# EAGLE design Tally Box With Ethernet (EAGLE 9.4.2)
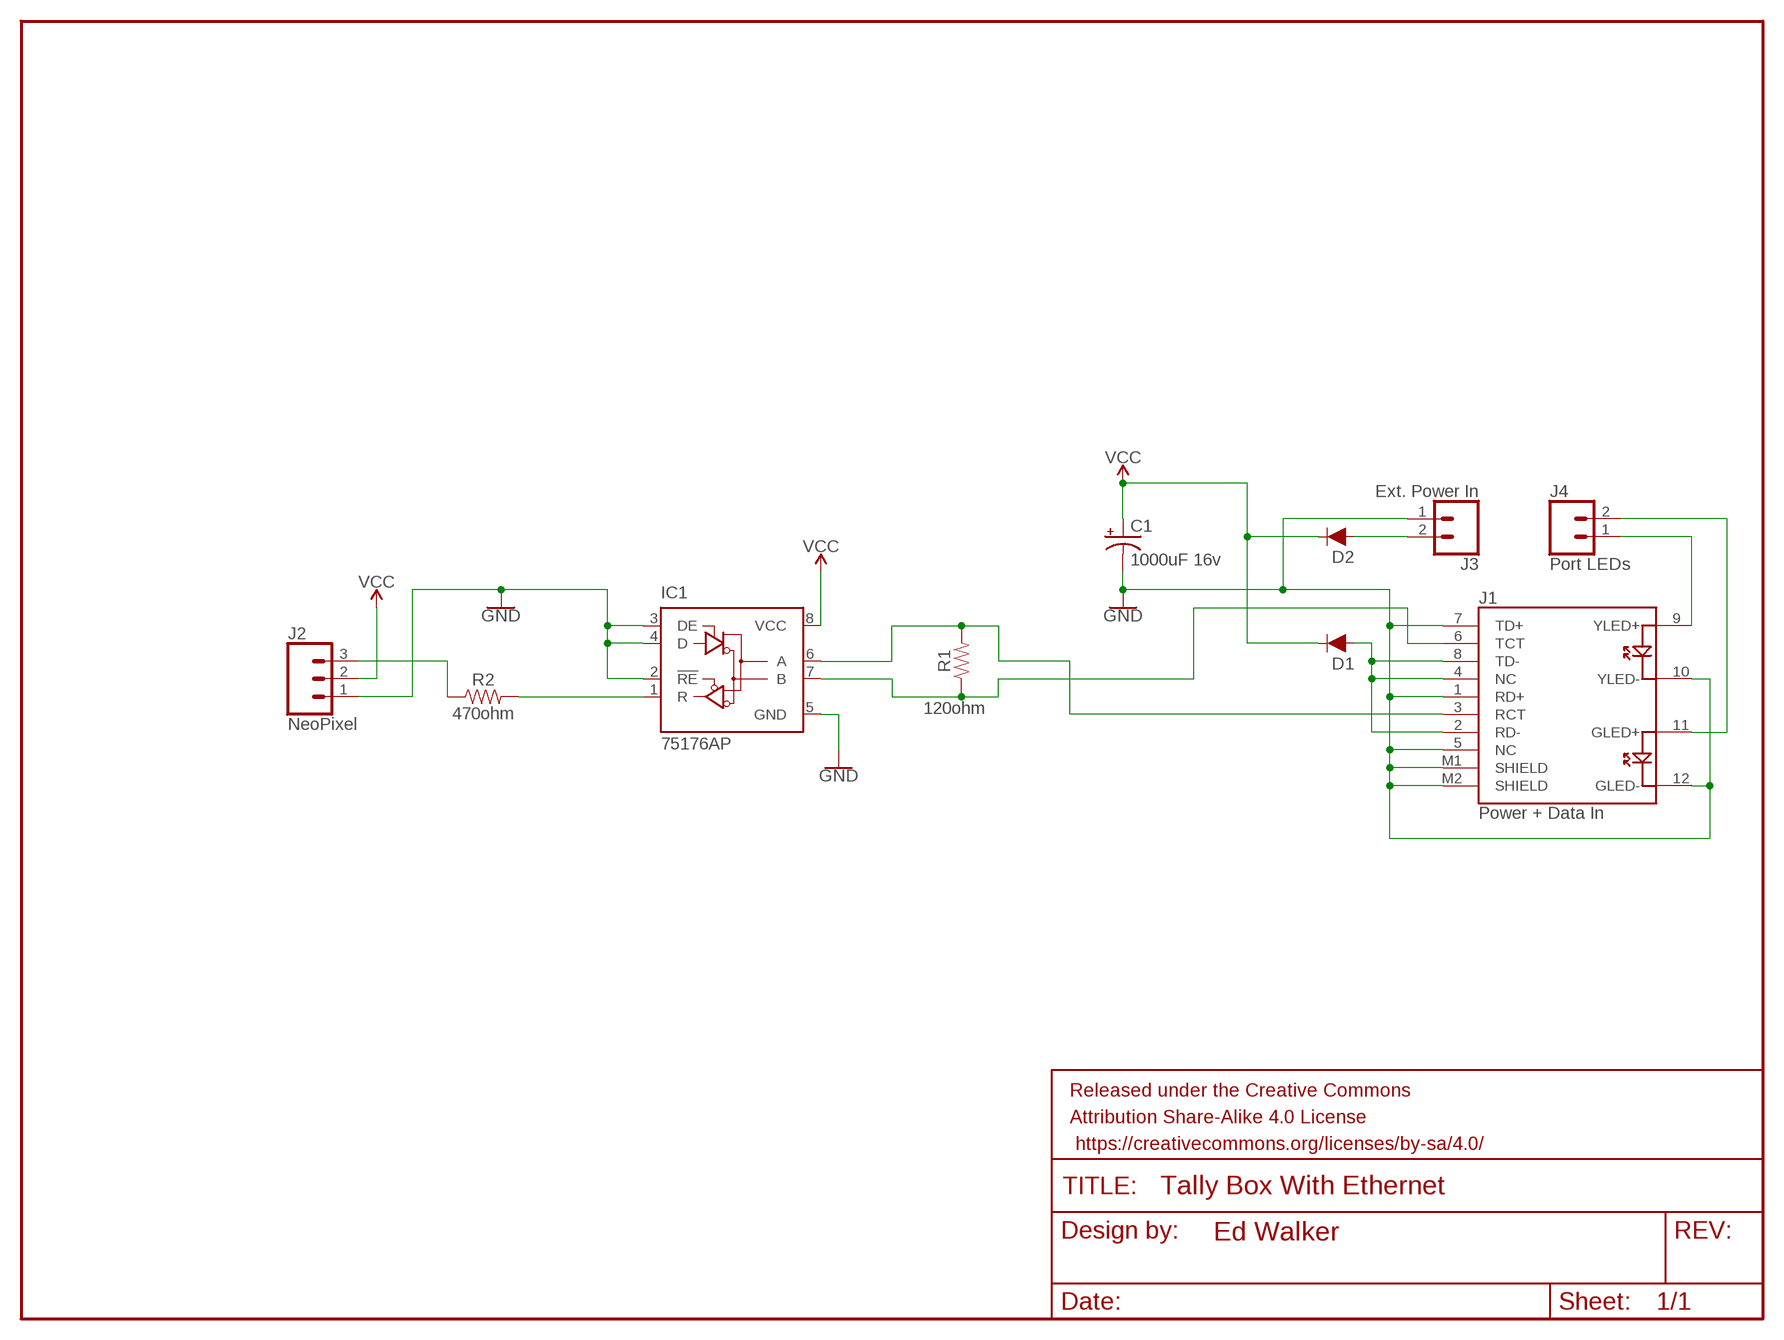
[diagram p0: schematic, sheet 1]

## Parts
C1  1000uF 16v  1000UF-RADIAL-5MM-25V-20%  [CPOL-RADIAL-5MM-10MM]
D1  DIODE-PTH  [DIODE-1N4001]
D2  DIODE-PTH  [DIODE-1N4001]
FRAME1  FRAME-LETTERNO_PACKAGE  [DUMMY]
IC1  75176AP  [DIL08]
J1  Power + Data In  MAGJACK  [MAGJACK]
J2  NeoPixel  CONN_03  [1X03]
J3  Ext. Power In  CONN_02  [1X02]
J4  Port LEDs  CONN_02  [1X02]
R1  120ohm  RESISTORAXIAL-0.3  [AXIAL-0.3]
R2  470ohm  RESISTORAXIAL-0.3  [AXIAL-0.3]

## Nets
DATA: J2.3 R2.P$1
DATA+: IC1.6(A) J1.3(RCT) R1.P$2
DATA-: IC1.7(B) J1.6(TCT) R1.P$1
DATAOUT: IC1.1(R) R2.P$2
GND: C1.- IC1.2(!RE) IC1.3(DE) IC1.4(D) IC1.5(GND) J1.1(RD+) J1.5(NC) J1.7(TD+) J1.10(YLED-) J1.12(GLED-) J1.M1(SHIELD) J1.M2(SHIELD) J2.1 J3.1
N$1: J1.9(YLED+) J4.1
N$2: J1.11(GLED+) J4.2
VCC: C1.+ D1.C D2.C IC1.8(VCC) J2.2
VIN1: D1.A J1.2(RD-) J1.4(NC) J1.8(TD-)
VIN2: D2.A J3.2

## Library data of the parts
C1 = SparkFun-Capacitors:1000UF: 1,000µF/1mF ceramic capacitors A capacitor is a passive two-terminal electrical component used to store electrical energy temporarily in an electric field. CAP-08070; PROD_ID: CAP-09538; VALUE: 1mF
D1 D2 = SparkFun-DiscreteSemi:DIODE: Diode These are standard reverse protection diodes and small signal diodes. SparkFun Products: SparkFun SparkPunk Sound Kit <https://www.sparkfun.com/products/11177> SparkFun ESP8266 Thing <https://www.sparkfun.com/products/13231>; PROD_ID: DIO-09176; VALUE: 1A/50V/1.1V
FRAME1 = SparkFun-Aesthetics:FRAME-LETTER: Schematic Frame - Letter Standard 8.5x11 US Letter frame; DESIGNER: Ed Walker; VERSION: v01
IC1 = 751xx:75176A: DIFFERENTIAL BUS TRANSCEIVER Source: http://focus.ti.com/lit/ds/symlink/sn75176a.pdf
J1 = SparkFun-Connectors:MAGJACK: MAGJACK: RJ-45 with LEDs This is a single port, RJ45 ethernet jacks with built in transformer (magnetics), status LEDs, and shielding. Here is the connector we sell at SparkFun: RJ45 Ethernet MagJack-Compatible <https://www.sparkfun.com/products/8534> (PRT-08534) Datasheet <http://www.sparkfun.com/datasheets/Prototyping/MagJack.pdf> It is used on this SparkFun product: SparkFun RJ45 MagJack Breakout <https://www.sparkfun.com/products/13021> (BOB-13021); PROD_ID: CONN-09556; SF_ID: PRT-08534
J2 = SparkFun-Connectors:CONN_03: Multi connection point. Often used as Generic Header-pin footprint for 0.1 inch spaced/style header connections On any of the 0.1 inch spaced packages, you can populate with these: Break Away Headers - Straight <https://www.sparkfun.com/products/116> (PRT-00116) Break Away Male Headers - Right Angle <https://www.sparkfun.com/products/553> (PRT-00553) Female Headers <https://www.sparkfun.com/products/115> (PRT-00115) Break Away Headers - Machine Pin <https://www.sparkfun.com/products/117> (PRT-00117) Break Away Female Headers - Swiss Machine Pin <https://www.sparkfun.com/products/743> (PRT-00743) Stackable Header - 3 Pin (Female, 0.1") <https://www.sparkfun.com/products/13875> (PRT-13875) For SCREWTERMINALS and SPRING TERMINALS visit here: Screw Terimnals on SparkFun.com <https://www.sparkfun.com/search/results?term=Screw+Terminals> (5mm/3.5mm/2.54mm spacing) This device is also useful as a general connection point to wire up your design to another part of your project. Our various solder wires solder well into these plated through hole pads. Hook-Up Wire - Assortment (Stranded, 22 AWG) <https://www.sparkfun.com/products/11375> (PRT-11375) Hook-Up Wire - Assortment (Solid Core, 22 AWG) <https://www.sparkfun.com/products/11367> (PRT-11367) View the entire wire category on our website here <https://www.sparkfun.com/categories/141> Special notes: Molex polarized connector foot print use with SKU : PRT-08232 with associated crimp pins and housings.; PROD_ID: XXX-00000; VALUE: 455-1750-1-ND
J3 J4 = SparkFun-Connectors:CONN_02: Multi connection point. Often used as Generic Header-pin footprint for 0.1 inch spaced/style header connections On any of the 0.1 inch spaced packages, you can populate with these: Break Away Headers - Straight <https://www.sparkfun.com/products/116> (PRT-00116) Break Away Male Headers - Right Angle <https://www.sparkfun.com/products/553> (PRT-00553) Female Headers <https://www.sparkfun.com/products/115> (PRT-00115) Break Away Headers - Machine Pin <https://www.sparkfun.com/products/117> (PRT-00117) Break Away Female Headers - Swiss Machine Pin <https://www.sparkfun.com/products/743> (PRT-00743) For SCREWTERMINALS and SPRING TERMINALS visit here: Screw Terimnals on SparkFun.com <https://www.sparkfun.com/search/results?term=Screw+Terminals> (5mm/3.5mm/2.54mm spacing) This device is also useful as a general connection point to wire up your design to another part of your project. Our various solder wires solder well into these plated through hole pads. Hook-Up Wire - Assortment (Stranded, 22 AWG) <https://www.sparkfun.com/products/11375> (PRT-11375) Hook-Up Wire - Assortment (Solid Core, 22 AWG) <https://www.sparkfun.com/products/11367> (PRT-11367) View the entire wire category on our website here <https://www.sparkfun.com/categories/141> Special notes: Molex polarized connector foot print use with: PRT-08233 with associated crimp pins and housings. 2.54_SCREWTERM for use with PRT-10571. 3.5mm Screw Terminal footprints for PRT-08084 5mm Screw Terminal footprints for use with PRT-08432
R1 R2 = SparkFun-Resistors:RESISTOR: Generic Resistor Package

## Board
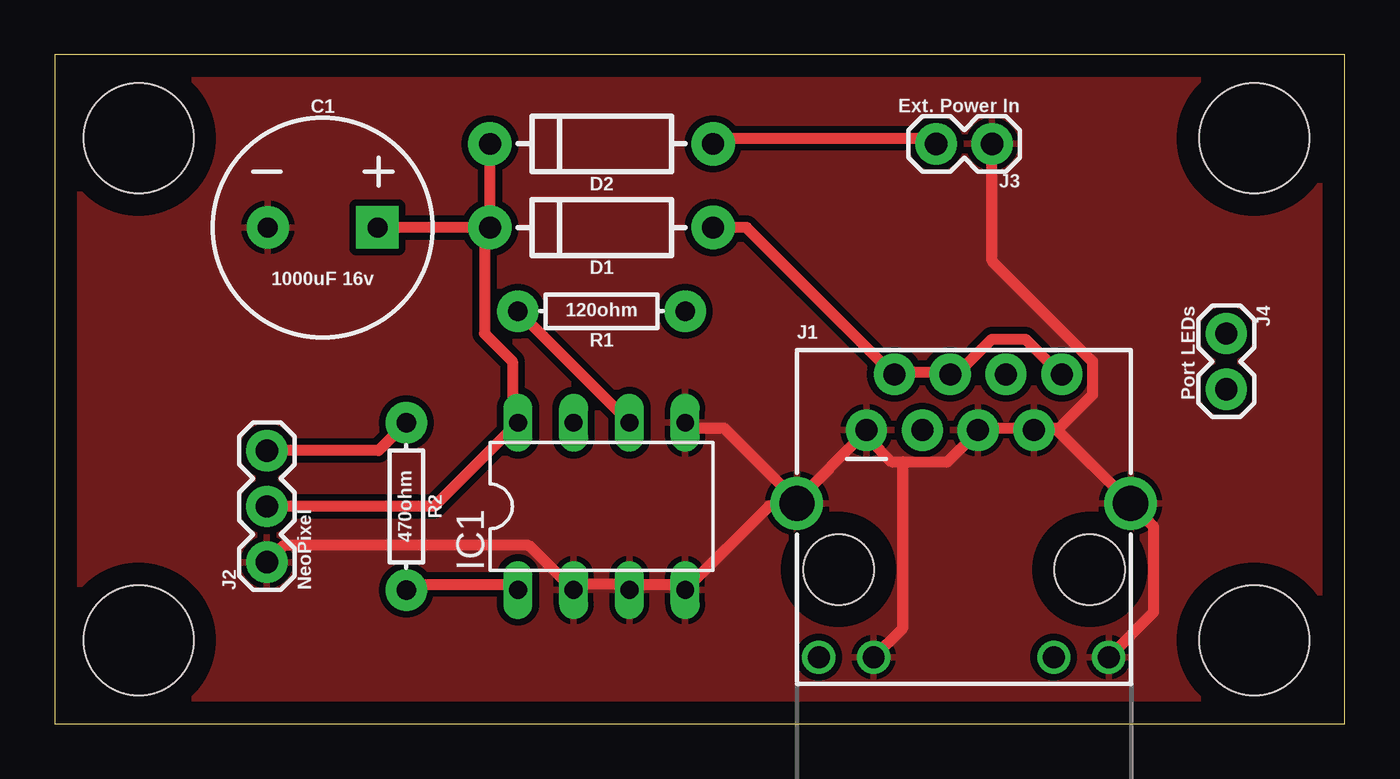
[diagram p1: board, top side]
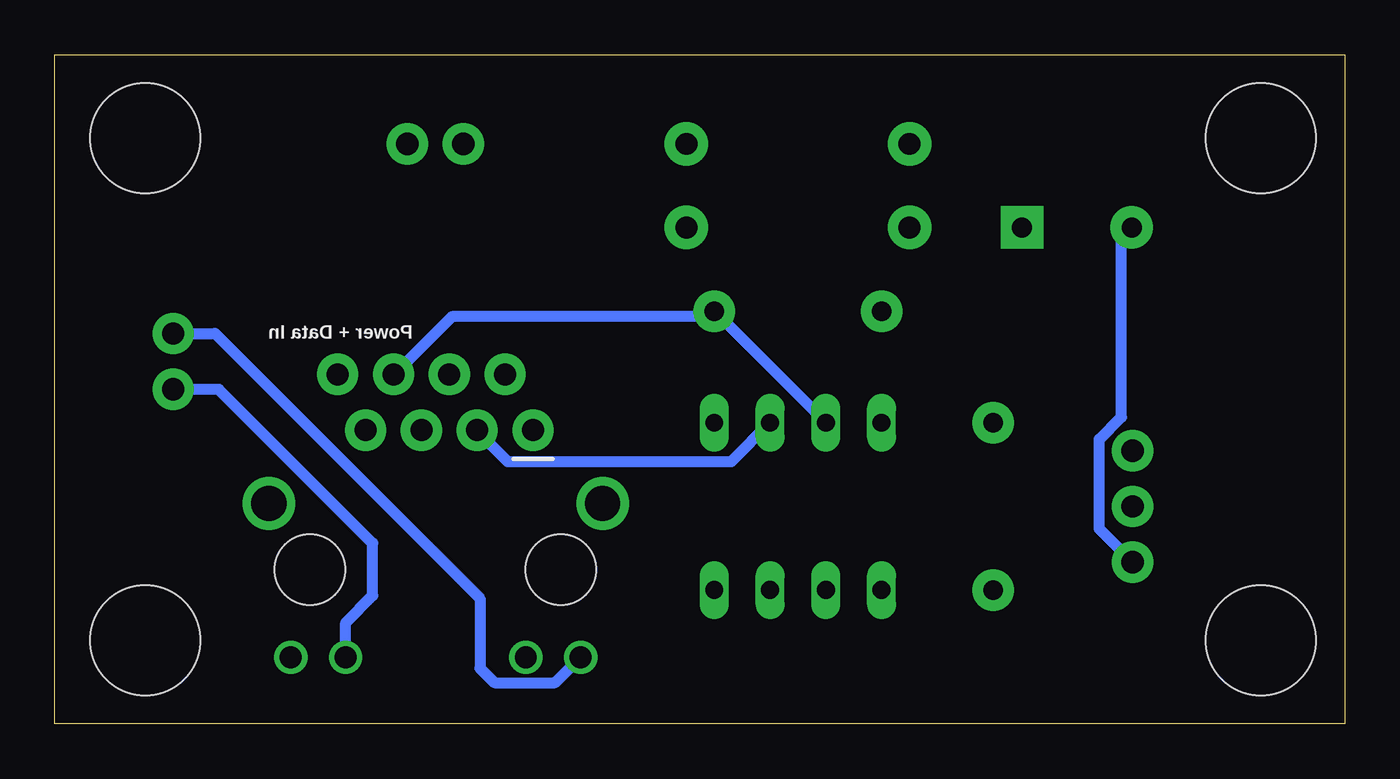
[diagram p2: board, bottom side, seen from below]

Size 58.73 x 30.47 mm. Coordinates in mm from the lower left corner, seen from the top.
Outline: 0,0 58.73,0 58.73,30.47 0,30.47 0,0
Copper layers (1*16): Top 0.035mm / dielectric 1.5mm / Bottom 0.035mm
Design rules "default": minimum track width 6mil, minimum drill 0.35mm, track to track 6mil, track to pad 6mil, pad to pad 6mil, via to via 6mil, smd to smd 6mil, copper to edge 40mil, drill to drill 6mil, minimum pad ring 10mil, minimum via ring 8mil, stop-mask expansion 4mil, vias tented up to drill 0mil, thermal gap 10mil
Holes 5 mm at 3.81,3.81 3.81,26.67 54.61,26.67 54.61,3.81

### Footprints (pad centres in the part's own frame; a part is rotated, then mirrored left to right if it is on the bottom)
CPOL-RADIAL-5MM-10MM = drill 0.9 pad 1.93 square: + 2.5,0 | drill 0.9 pad 1.93: - -2.5,0
DIODE-1N4001 = drill 1 pad 1.981: A -5.08,0; C 5.08,0
DIL08 = drill 0.813 long: 1 -3.81,-3.81; 2 -1.27,-3.81; 3 1.27,-3.81; 4 3.81,-3.81; 5 3.81,3.81; 6 1.27,3.81; 7 -1.27,3.81; 8 -3.81,3.81
MAGJACK = drill 1 pad 1.88: 1 3.175,17.445; 2 4.445,19.985; 3 5.715,17.445; 4 6.985,19.985; 5 8.255,17.445; 6 9.525,19.985; 7 10.795,17.445; 8 12.065,19.985 | drill 1 pad 1.27: 9 1,7.1; 10 3.5,7.1; 11 11.7,7.1; 12 14.2,7.1 | drill 1.6 pad 2.184: M1 0,14.1; M2 15.2,14.1 | hole 3.2: 1.905,11.095; 13.335,11.095
1X03 = drill 1.016 pad 1.88: 1 0,0; 2 2.54,0; 3 5.08,0
1X02 = drill 1.016 pad 1.88: 1 0,0; 2 2.54,0
AXIAL-0.3 = drill 0.9 pad 1.88: P$1 -3.81,0; P$2 3.81,0

### Placement (x,y rotation side)
C1  12.19,22.61 0 top
D1  24.89,22.61 180 top
D2  24.89,26.42 180 top
FRAME1  -34.29,39.37 0 top  (outside the outline)
IC1  24.89,9.91 0 top
J1  33.78,-4.06 0 top
J2  9.65,7.37 90 top
J3  42.67,26.42 180 top
J4  53.34,17.78 270 top
R1  24.89,18.8 180 top
R2  16,9.91 270 top

### Tracks (layer width: path | path; a pad name or v marks a point on that pad's centre or on a via)
DATA
  Top 0.508: J2.3 14.73,12.45 R2.P$1
DATA+
  Top 0.508: R1.P$2 IC1.6
  Bottom 0.508: IC1.6 27.94,11.94 38.1,11.94 39.12,12.95 J1.3
DATA-
  Bottom 0.508: IC1.7 R1.P$1 28.96,18.54 40.64,18.54 43.18,16 J1.6
DATAOUT
  Top 0.508: IC1.1 20.83,6.35 16.26,6.35 R2.P$2
GND
  Top 0.508: J3.1 42.67,21.08 47.24,16.51 47.24,14.99 45.72,13.46 45.56,13.46 | IC1.5 28.96,13.46 30.48,13.46 33.53,10.41 J1.M1 | J1.M1 34.04,10.41 36.58,12.95 J1.1 37.08,12.95 38.1,11.94 38.61,11.94 | J2.1 10.41,8.13 21.59,8.13 IC1.2 23.88,6.35 25.91,6.35 IC1.3 26.42,6.35 28.45,6.35 IC1.4 32.51,9.91 33.53,9.91 J1.M1 | 38.61,11.94 40.64,11.94 41.66,12.95 J1.5 42.16,13.46 44.2,13.46 J1.7 44.66,13.46 45.56,13.46 | 45.56,13.46 J1.M2 50.04,8.98 50.04,5.09 J1.12 | J1.10 38.61,4.36 38.61,11.94
  Bottom 0.508: J2.1 11.18,8.89 11.18,12.95 10.16,13.97 10.16,22.61 C1.-
  pour Top (isolate 0.305): 0,30.48 58.42,30.48 58.42,0 0,0
N$1
  Bottom 0.508: J4.1 51.44,17.78 39.37,5.71 39.37,2.54 38.71,1.88 35.94,1.88 J1.9
N$2
  Bottom 0.508: J1.11 45.48,4.61 44.25,5.84 44.25,8.22 51.27,15.24 J4.2
VCC
  Top 0.508: D1.C 19.56,22.35 19.56,17.78 20.83,16.51 20.83,13.97 IC1.8 17.27,9.91 J2.2 | D1.C C1.+ | D1.C D2.C
VIN1
  Top 0.508: J1.8 45.72,16 44.2,17.53 42.67,17.53 41.15,16 J1.4 40.64,16 38.61,16 J1.2 38.1,16 31.5,22.61 D1.A
VIN2
  Top 0.508: J3.2 40.13,26.67 29.97,26.67 D2.A